# Altium schematic sheet Thermal_Sense.SchDoc
size A4
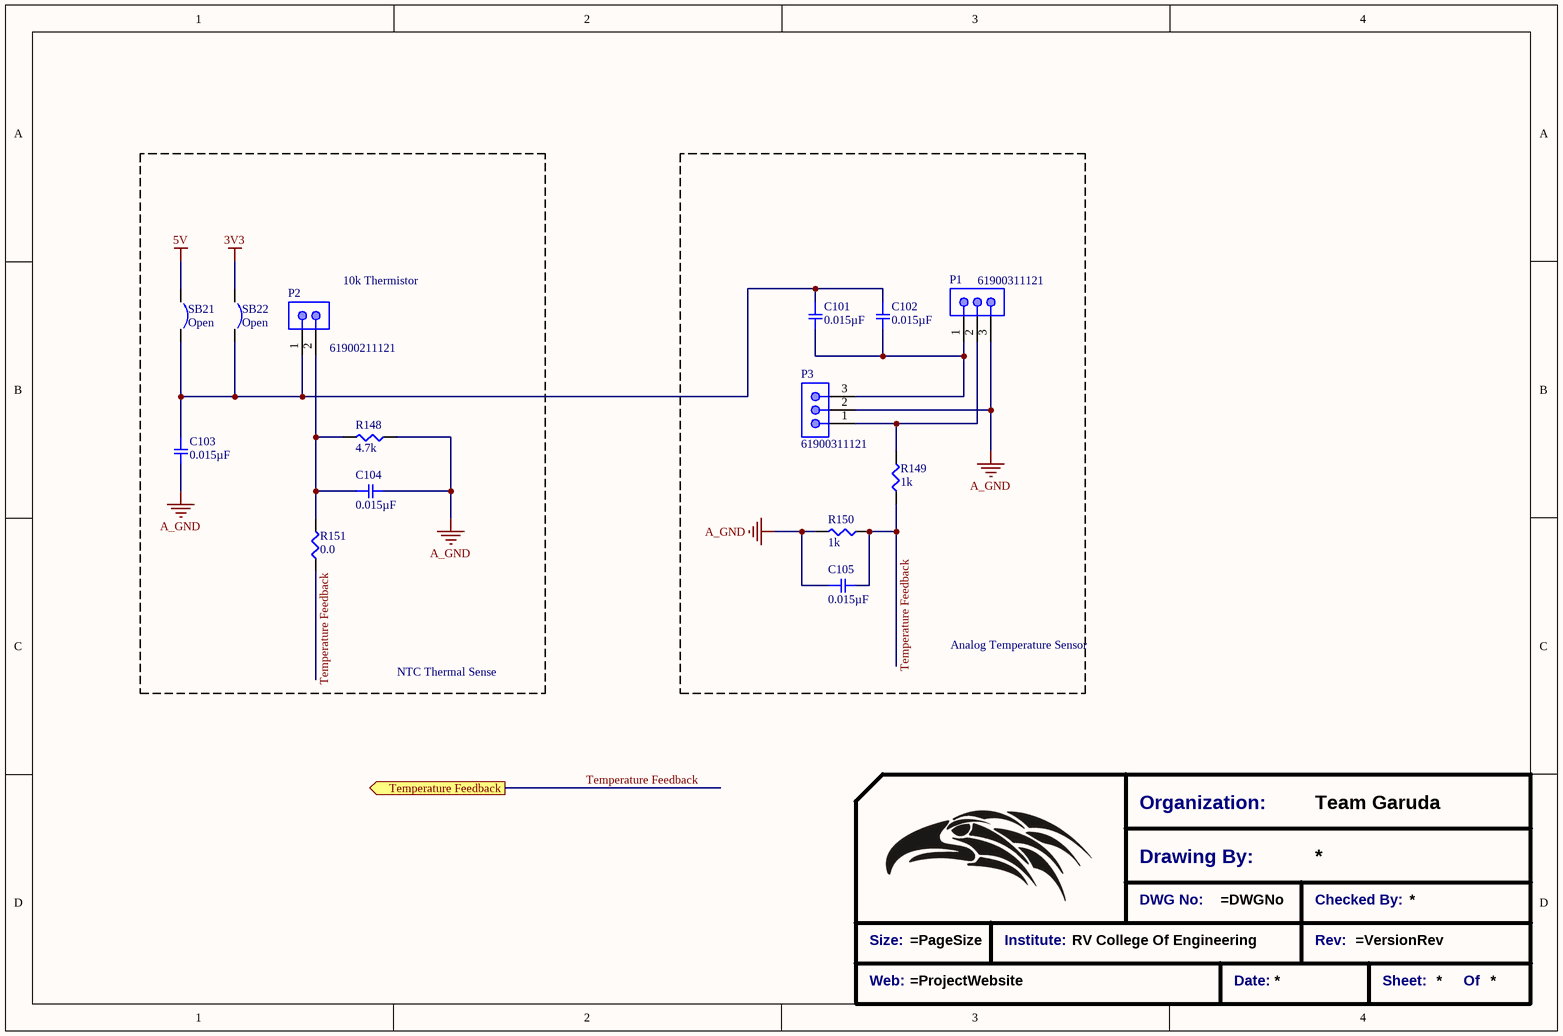
[diagram p0: Thermal_Sense.SchDoc]

## Parts
*?  Title_Block  (value not drawn)  (graphical)
C101  0.015µF  [SMD-0805C]
C102  0.015µF  [SMD-0805C]
C103  0.015µF  [SMD-0805C]
C104  0.015µF  [SMD-0805C]
C105  0.015µF  [SMD-0805C]
P1  61900311121  [61900311121]
P2  61900211121  [61900211121]
P3  61900311121  [61900311121]
R148  4.7k  [SMD-0603-RES]
R149  1k  [SMD-0603-RES]
R150  1k  [SMD-0603-RES]
R151  0.0  [SMD-0603-RES]
SB21  Open  [Solder Bridge - HP - SQ]  (no BOM)
SB22  Open  [Solder Bridge - HP - SQ]  (no BOM)

## Blocks framed on the sheet
Analog Temperature Sensor: C101 C102 C105 P1 P3 R149 R150

## Ports
Temperature Feedback (out)

## Nets
3V3: SB22.1
5V: SB21.1
A_GND: C103.2 C104.2 C105.1 P1.3 P3.2 R148.1 R150.2
Temperature Feedback: C105.2 R149.1 R150.1 R151.1 ; port Temperature Feedback
NetC101_1: C101.1 C102.1 C103.1 P2.1 SB21.2 SB22.2
NetC101_2: C101.2 C102.2 P1.1 P3.3
NetC104_1: C104.1 P2.2 R148.2 R151.2
NetP1_2: P1.2 P3.1 R149.2

## Notes on the sheet
- (near P2) 10k Thermistor
- NTC Thermal Sense
- (in symbol Title_Block) Organization:; Team Garuda; Drawing By:; DWG No:; Checked By:; Size:; Institute:; RV College Of Engineering; Rev:; Web:; Date:; Sheet:; Of

## Library data of the parts
*? = Title_Block: Standard Title Block
C101-C105 = GC321AD72E153KX01D: CAP CER 0.015UF 250V X7T 0805; Manufacturer: Murata Electronics North America; Factory Stock: 0; Unit Price (USD): 0.27; Minimum Quantity: 1; Tolerance: ±10%; Datasheets: http://search.murata.co.jp/Ceramy/image/img/A01X/G101/ENG/GC321AD72E153KX01-01.pdf; Image: //media.digikey.com/Renders/Murata%20Renders/0805(GC3)200x125.jpg; Digi-Key Part Number: 490-13987-1-ND; Part Number: GC321AD72E153KX01D; Quantity Available: 4000; @ qty: 0; Packaging: Cut Tape (CT); Series: GC3; Part Status: Active; Value: 0.015µF; Voltage: 250V; Temperature Coefficient: X7T; Operating Temperature: -55°C ~ 125°C; Features: -; Ratings: AEC-Q200; Applications: Automotive; Mounting Type: Surface Mount, MLCC; Package / Case: 0805 (2012 Metric); Size / Dimension: 0.079" L x 0.049" W (2.00mm x 1.25mm); Height - Seated (Max): -; Thickness (Max): 0.039" (1.00mm); Lead Spacing: -; Lead Style: -
P1 P3 = 61900311121: WR-WTB THT Male Vertical Locking Header, pitch 2.54mm, 3p; Pin Number: 3; Contact Resistance: 20mOhm; Rated Current: 3A; Withstanding Voltage: 1000VAC; Working Voltage: 250VAC; ComponentLink1Description: Manufacturer; ComponentLink1URL: http://www.we-online.de; ComponentLink2Description: Datasheet; ComponentLink2URL: https://www.we-online.com/catalog/datasheet/61900311121.pdf; Pitch: 2.54mm; Published Date: January 2020; Publisher: Wurth Elektronik; Mounting Technology: THT; Packaging: Bag; Operating Temperature: -40 to +105degC; Part Number: 61900311121; Gender: Male; Type: Vertical
P2 = 61900211121: WR-WTB THT Male Vertical Locking Header, pitch 2.54mm, 2p; Pin Number: 2; Contact Resistance: 20mOhm; Rated Current: 3A; Withstanding Voltage: 1000VAC; Working Voltage: 250VAC; ComponentLink1Description: Manufacturer; ComponentLink1URL: http://www.we-online.de; ComponentLink2Description: Datasheet; ComponentLink2URL: https://www.we-online.com/catalog/datasheet/61900211121.pdf; Pitch: 2.54mm; Published Date: January 2020; Publisher: Wurth Elektronik; Mounting Technology: THT; Packaging: Bag; Operating Temperature: -40 to +105degC; Part Number: 61900211121; Gender: Male; Type: Vertical
R148 = ERJ-3EKF4701V: RES SMD 4.7K OHM 1% 1/10W 0603; Manufacturer: Panasonic Electronic Components; Factory Stock: 0; Unit Price (USD): 0.00379; @ qty: 1500; Minimum Quantity: 1; Power (Watts): 0.1W, 1/10W; Temperature Coefficient: ±100ppm/°C; Part Number: ERJ-3EKF4701V; Datasheets: http://industrial.panasonic.com/www-cgi/jvcr13pz.cgi?E+PZ+3+AOA0002+ERJ3EKF4701V+7+WW; Image: //media.digikey.com/Photos/Panasonic%20Photos/MFG_ERJ-P6W%20Series.jpg; Digi-Key Part Number: P4.70KHCT-ND; Quantity Available: 999380; Packaging: Cut Tape (CT); Series: ERJ; Part Status: Active; Value: 4.7k; Tolerance: ±1%; Composition: Thick Film; Features: Automotive AEC-Q200; Operating Temperature: -55°C ~ 155°C; Package / Case: 0603 (1608 Metric); Supplier Device Package: 0603; Size / Dimension: 0.063" L x 0.031" W (1.60mm x 0.80mm); Height - Seated (Max): 0.022" (0.55mm); Number of Terminations: 2; Failure Rate: -
R149 R150 = ERJ-3EKF1001V: RES SMD 1K OHM 1% 1/10W 0603; Manufacturer: Panasonic Electronic Components; Factory Stock: 0; Unit Price (USD): 0.00379; @ qty: 1500; Minimum Quantity: 1; Power (Watts): 0.1W, 1/10W; Temperature Coefficient: ±100ppm/°C; Part Number: ERJ-3EKF1001V; Datasheets: http://industrial.panasonic.com/www-cgi/jvcr13pz.cgi?E+PZ+3+AOA0002+ERJ3EKF1001V+7+WW; Image: //media.digikey.com/Photos/Panasonic%20Photos/MFG_ERJ-P6W%20Series.jpg; Digi-Key Part Number: P1.00KHCT-ND; Quantity Available: 5218845; Packaging: Cut Tape (CT); Series: ERJ; Part Status: Active; Value: 1k; Tolerance: ±1%; Composition: Thick Film; Features: Automotive AEC-Q200; Operating Temperature: -55°C ~ 155°C; Package / Case: 0603 (1608 Metric); Supplier Device Package: 0603; Size / Dimension: 0.063" L x 0.031" W (1.60mm x 0.80mm); Height - Seated (Max): 0.022" (0.55mm); Number of Terminations: 2; Failure Rate: -
R151 = ERJ-3GEY0R00V: RES SMD 0.0OHM JUMPER 1/10W 0603; Manufacturer: Panasonic Electronic Components; Factory Stock: 0; Unit Price (USD): 0.00352; @ qty: 1500; Minimum Quantity: 1; Power (Watts): 0.1W, 1/10W; Part Number: ERJ-3GEY0R00V; Datasheets: http://industrial.panasonic.com/www-cgi/jvcr13pz.cgi?E+PZ+3+AOA0001+ERJ3GEY0R00V+7+WW; Image: //media.digikey.com/Photos/Panasonic%20Photos/MFG_ERJ-P6W%20Series.jpg; Digi-Key Part Number: P0.0GCT-ND; Quantity Available: 4813372; Packaging: Cut Tape (CT); Series: ERJ; Part Status: Active; Value: 0.0; Tolerance: Jumper; Composition: Thick Film; Features: Automotive AEC-Q200; Temperature Coefficient: -; Operating Temperature: -55°C ~ 155°C; Package / Case: 0603 (1608 Metric); Supplier Device Package: 0603; Size / Dimension: 0.063" L x 0.031" W (1.60mm x 0.80mm); Height - Seated (Max): 0.022" (0.55mm); Number of Terminations: 2; Failure Rate: -
SB21 SB22 = Solder Bridge: Circuit Breaker; Published: 24-Mar-1999; Revision: July-2002: Re-released for DXP Platform.; Publisher: Altium Limited